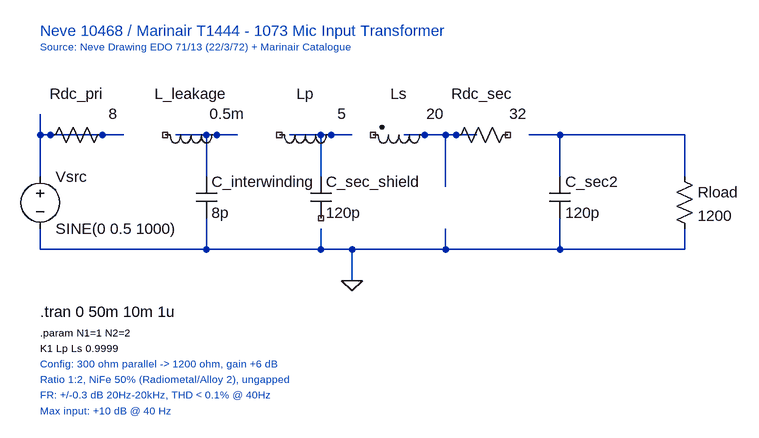
[diagram p0: schematic neve_10468_input.asc]
neve_10468_input.asc, the LTspice schematic file:
Version 4
SHEET 1 1200 680
WIRE 48 128 48 96
WIRE 176 128 48 128
WIRE 304 128 256 128
WIRE 352 128 304 128
WIRE 480 128 432 128
WIRE 528 128 480 128
WIRE 672 128 608 128
WIRE 720 128 672 128
WIRE 848 128 800 128
WIRE 912 128 848 128
WIRE 1040 128 912 128
WIRE 48 192 48 128
WIRE 304 192 304 128
WIRE 480 192 480 128
WIRE 672 208 672 128
WIRE 848 192 848 128
WIRE 1040 192 1040 128
WIRE 48 304 48 272
WIRE 304 304 304 256
WIRE 304 304 48 304
WIRE 480 304 480 272
WIRE 480 304 304 304
WIRE 672 304 672 272
WIRE 672 304 480 304
WIRE 848 304 848 256
WIRE 848 304 672 304
WIRE 1040 304 1040 272
WIRE 1040 304 848 304
WIRE 528 352 528 304
FLAG 528 352 0
SYMBOL voltage 48 176 R0
SYMATTR InstName Vsrc
SYMATTR Value SINE(0 0.5 1000)
SYMATTR SpiceLine Rser=300
SYMBOL res 160 112 R90
WINDOW 0 -32 56 VBottom 2
WINDOW 3 -32 0 VTop 2
SYMATTR InstName Rdc_pri
SYMATTR Value 8
SYMBOL ind 336 112 R90
WINDOW 0 -32 56 VBottom 2
WINDOW 3 -32 0 VTop 2
SYMATTR InstName L_leakage
SYMATTR Value 0.5m
SYMBOL ind 512 112 R90
WINDOW 0 -32 56 VBottom 2
WINDOW 3 -32 0 VTop 2
SYMATTR InstName Lp
SYMATTR Value 5
SYMBOL ind2 656 112 R90
WINDOW 0 -32 56 VBottom 2
WINDOW 3 -32 0 VTop 2
SYMATTR InstName Ls
SYMATTR Value 20
SYMATTR SpiceLine Rser=0
SYMBOL res 784 112 R90
WINDOW 0 -32 56 VBottom 2
WINDOW 3 -32 0 VTop 2
SYMATTR InstName Rdc_sec
SYMATTR Value 32
SYMBOL res 1024 176 R0
SYMATTR InstName Rload
SYMATTR Value 1200
SYMBOL cap 288 192 R0
SYMATTR InstName C_interwinding
SYMATTR Value 8p
SYMBOL cap 464 192 R0
SYMATTR InstName C_sec_shield
SYMATTR Value 120p
SYMBOL cap 832 192 R0
SYMATTR InstName C_sec2
SYMATTR Value 120p
TEXT 48 -32 Left 2 ;Neve 10468 / Marinair T1444 - 1073 Mic Input Transformer
TEXT 48 -8 Left 1 ;Source: Neve Drawing EDO 71/13 (22/3/72) + Marinair Catalogue
TEXT 48 400 Left 2 !.tran 0 50m 10m 1u
TEXT 48 432 Left 1 !.param N1=1 N2=2
TEXT 48 456 Left 1 !K1 Lp Ls 0.9999
TEXT 48 480 Left 1 ;Config: 300 ohm parallel -> 1200 ohm, gain +6 dB
TEXT 48 504 Left 1 ;Ratio 1:2, NiFe 50% (Radiometal/Alloy 2), ungapped
TEXT 48 528 Left 1 ;FR: +/-0.3 dB 20Hz-20kHz, THD < 0.1% @ 40Hz
TEXT 48 552 Left 1 ;Max input: +10 dB @ 40 Hz

The netlist it stands for:
* neve_10468_input.asc
Vsrc N001 0 SINE(0 0.5 1000) Rser=300
Rdc_pri N001 N001 8
L_leakage N002 NC_01 0.5m
Lp N003 NC_02 5
Ls N004 NC_03 20 Rser=0
Rdc_sec NC_04 N004 32
Rload N005 0 1200
C_interwinding N002 0 8p
C_sec_shield N003 NC_05 120p
C_sec2 N005 0 120p
* Neve 10468 / Marinair T1444 - 1073 Mic Input Transformer
* Source: Neve Drawing EDO 71/13 (22/3/72) + Marinair Catalogue
.tran 0 50m 10m 1u
.param N1=1 N2=2
K1 Lp Ls 0.9999
* Config: 300 ohm parallel -> 1200 ohm, gain +6 dB
* Ratio 1:2, NiFe 50% (Radiometal/Alloy 2), ungapped
* FR: +/-0.3 dB 20Hz-20kHz, THD < 0.1% @ 40Hz
* Max input: +10 dB @ 40 Hz
.backanno
.end